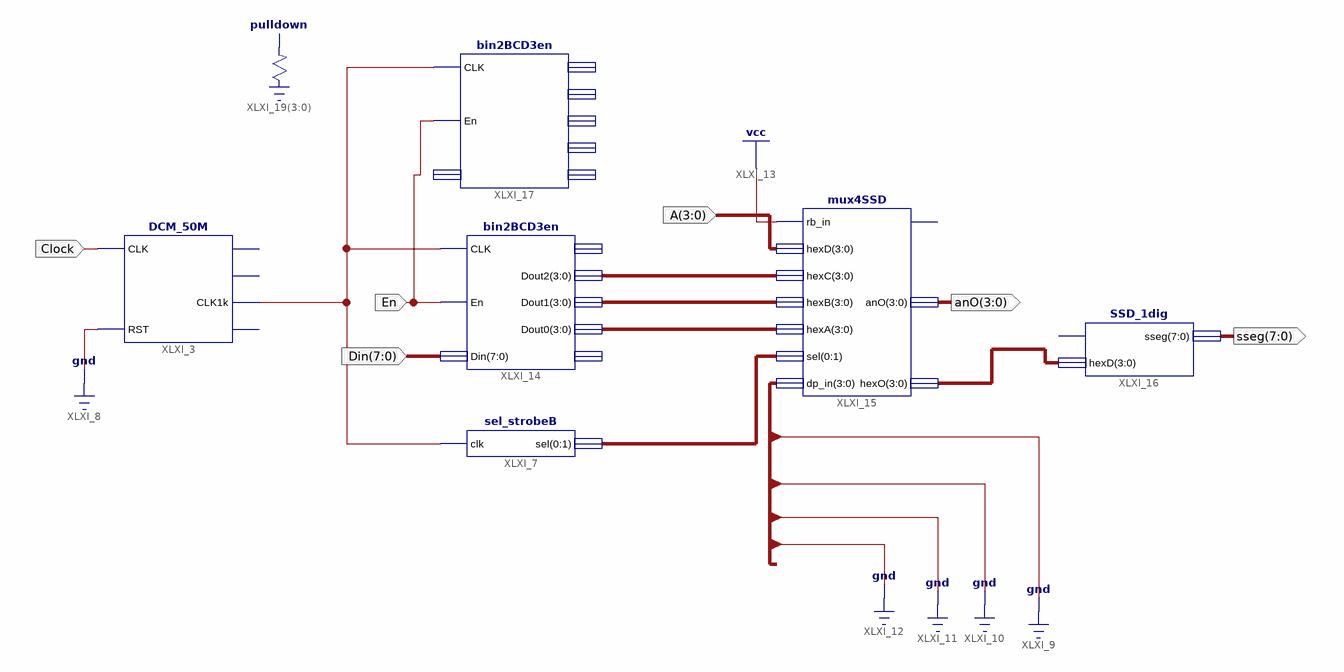
[diagram p0: schematic sheet 1]
// Xilinx ISE schematic lab9_BCDBus.sch (spartan3e) as structural Verilog: 7 symbols, 6 ports
module lab9_BCDBus (
  input  En,
  input  [7:0] Din,
  input  Clock,
  input  [3:0] A,
  output [7:0] sseg,
  output [3:0] anO
);

  wire XLXN_55;
  wire [1:0] XLXN_15;
  wire [3:0] XLXN_6, XLXN_7, XLXN_8, XLXN_13;

  SSD_1dig XLXI_16 (.hexD(XLXN_13), .sseg(sseg));  // open: dp_in
  DCM_50M XLXI_3 (.CLK(Clock), .RST(1'b0), .CLK1k(XLXN_55));  // open: CLK1M, CLK10k, CLK1
  sel_strobeB XLXI_7 (.clk(XLXN_55), .sel({XLXN_15[0], XLXN_15[1]}));
  bin2BCD3en XLXI_14 (
    .CLK(XLXN_55), .En(En), .Din(Din), .Dout2(XLXN_8), .Dout1(XLXN_7), .Dout0(XLXN_6));  // open: Dout3, RBout
  mux4SSD XLXI_15 (
    .rb_in(1'b1), .hexD(A), .hexC(XLXN_8), .hexB(XLXN_7), .hexA(XLXN_6), .sel({XLXN_15[0], XLXN_15[1]}),
    .dp_in(4'b0000), .anO(anO), .hexO(XLXN_13));  // open: dpO
  bin2BCD3en XLXI_17 (.CLK(XLXN_55), .En(En));  // open: Din, Dout3, Dout2, Dout1, Dout0, RBout
  \pulldown  XLXI_19[3:0] ();  // open: O
endmodule
